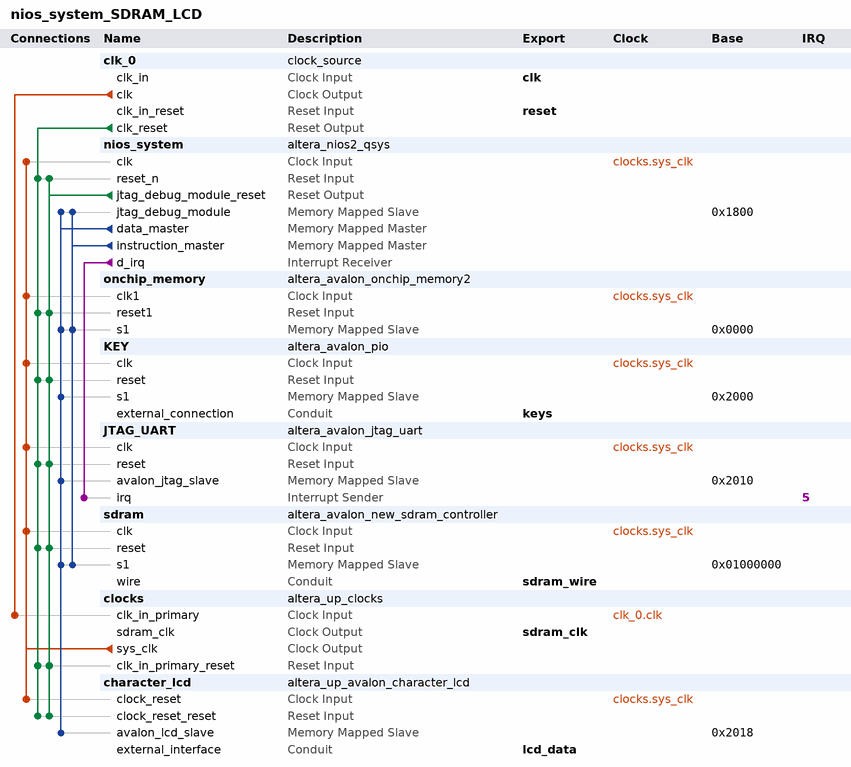
[diagram p0: system contents]
# Platform Designer (Qsys) system nios_system_SDRAM_LCD, Cyclone II EP2C35F672C6
# Parameters at their usual value, and those the tool derives, are not listed.
package require -exact qsys 12.0
create_system nios_system_SDRAM_LCD
set_project_property DEVICE_FAMILY {Cyclone II}
set_project_property DEVICE EP2C35F672C6

add_instance clk_0 clock_source 12.0
set_instance_parameter_value clk_0 clockFrequency 50000000

add_instance nios_system altera_nios2_qsys 12.0
set_instance_parameter_value nios_system resetSlave sdram.s1
set_instance_parameter_value nios_system exceptionSlave sdram.s1
set_instance_parameter_value nios_system breakSlave nios_system.jtag_debug_module
set_instance_parameter_value nios_system impl Small
set_instance_parameter_value nios_system icache_size 4096

add_instance onchip_memory altera_avalon_onchip_memory2 12.0
set_instance_parameter_value onchip_memory dataWidth 32
set_instance_parameter_value onchip_memory dualPort false
set_instance_parameter_value onchip_memory initMemContent true
set_instance_parameter_value onchip_memory initializationFileName onchip_memory
set_instance_parameter_value onchip_memory memorySize 4096

add_instance KEY altera_avalon_pio 12.0
set_instance_parameter_value KEY direction Input
set_instance_parameter_value KEY width 8

add_instance JTAG_UART altera_avalon_jtag_uart 12.0
set_instance_parameter_value JTAG_UART simInteractiveOptions INTERACTIVE_ASCII_OUTPUT

add_instance sdram altera_avalon_new_sdram_controller 12.0
set_instance_parameter_value sdram TAC 5.5
set_instance_parameter_value sdram TRCD 20.0
set_instance_parameter_value sdram TRP 20.0
set_instance_parameter_value sdram casLatency 3
set_instance_parameter_value sdram columnWidth 8
set_instance_parameter_value sdram dataWidth 16
set_instance_parameter_value sdram generateSimulationModel false
set_instance_parameter_value sdram model custom
set_instance_parameter_value sdram numberOfBanks 4
set_instance_parameter_value sdram numberOfChipSelects 1
set_instance_parameter_value sdram powerUpDelay 100.0
set_instance_parameter_value sdram refreshPeriod 15.625
set_instance_parameter_value sdram rowWidth 12

add_instance clocks altera_up_clocks 12.0
set_instance_parameter_value clocks board DE2
set_instance_parameter_value clocks vga_clk false
set_instance_parameter_value clocks audio_clk false
set_instance_parameter_value clocks audio_clk_freq 12.288

add_instance character_lcd altera_up_avalon_character_lcd 12.0
set_instance_parameter_value character_lcd cursor Normal

# connections
add_connection clk_0.clk clocks.clk_in_primary clock
add_connection clocks.sys_clk character_lcd.clock_reset clock
add_connection clocks.sys_clk JTAG_UART.clk clock
add_connection clocks.sys_clk KEY.clk clock
add_connection clocks.sys_clk nios_system.clk clock
add_connection clocks.sys_clk onchip_memory.clk1 clock
add_connection clocks.sys_clk sdram.clk clock
add_connection clk_0.clk_reset character_lcd.clock_reset_reset reset
add_connection clk_0.clk_reset clocks.clk_in_primary_reset reset
add_connection clk_0.clk_reset JTAG_UART.reset reset
add_connection clk_0.clk_reset KEY.reset reset
add_connection clk_0.clk_reset nios_system.reset_n reset
add_connection clk_0.clk_reset onchip_memory.reset1 reset
add_connection clk_0.clk_reset sdram.reset reset
add_connection nios_system.jtag_debug_module_reset character_lcd.clock_reset_reset reset
add_connection nios_system.jtag_debug_module_reset clocks.clk_in_primary_reset reset
add_connection nios_system.jtag_debug_module_reset JTAG_UART.reset reset
add_connection nios_system.jtag_debug_module_reset KEY.reset reset
add_connection nios_system.jtag_debug_module_reset nios_system.reset_n reset
add_connection nios_system.jtag_debug_module_reset onchip_memory.reset1 reset
add_connection nios_system.jtag_debug_module_reset sdram.reset reset
add_connection nios_system.data_master character_lcd.avalon_lcd_slave avalon
set_connection_parameter_value nios_system.data_master/character_lcd.avalon_lcd_slave baseAddress 0x2018
add_connection nios_system.data_master JTAG_UART.avalon_jtag_slave avalon
set_connection_parameter_value nios_system.data_master/JTAG_UART.avalon_jtag_slave baseAddress 0x2010
add_connection nios_system.data_master KEY.s1 avalon
set_connection_parameter_value nios_system.data_master/KEY.s1 baseAddress 0x2000
add_connection nios_system.data_master nios_system.jtag_debug_module avalon
set_connection_parameter_value nios_system.data_master/nios_system.jtag_debug_module baseAddress 0x1800
add_connection nios_system.data_master onchip_memory.s1 avalon
set_connection_parameter_value nios_system.data_master/onchip_memory.s1 baseAddress 0x0000
add_connection nios_system.data_master sdram.s1 avalon
set_connection_parameter_value nios_system.data_master/sdram.s1 baseAddress 0x01000000
add_connection nios_system.instruction_master nios_system.jtag_debug_module avalon
set_connection_parameter_value nios_system.instruction_master/nios_system.jtag_debug_module baseAddress 0x1800
add_connection nios_system.instruction_master onchip_memory.s1 avalon
set_connection_parameter_value nios_system.instruction_master/onchip_memory.s1 baseAddress 0x0000
add_connection nios_system.instruction_master sdram.s1 avalon
set_connection_parameter_value nios_system.instruction_master/sdram.s1 baseAddress 0x01000000
add_connection nios_system.d_irq JTAG_UART.irq interrupt
set_connection_parameter_value nios_system.d_irq/JTAG_UART.irq irqNumber 5

# exported interfaces
add_interface clk clock sink
set_interface_property clk EXPORT_OF clk_0.clk_in
add_interface reset reset sink
set_interface_property reset EXPORT_OF clk_0.clk_in_reset
add_interface keys conduit end
set_interface_property keys EXPORT_OF KEY.external_connection
add_interface sdram_wire conduit end
set_interface_property sdram_wire EXPORT_OF sdram.wire
add_interface sdram_clk clock source
set_interface_property sdram_clk EXPORT_OF clocks.sdram_clk
add_interface lcd_data conduit end
set_interface_property lcd_data EXPORT_OF character_lcd.external_interface

save_system nios_system_SDRAM_LCD.qsys
